# Altium schematic sheet mcu.SchDoc
size A
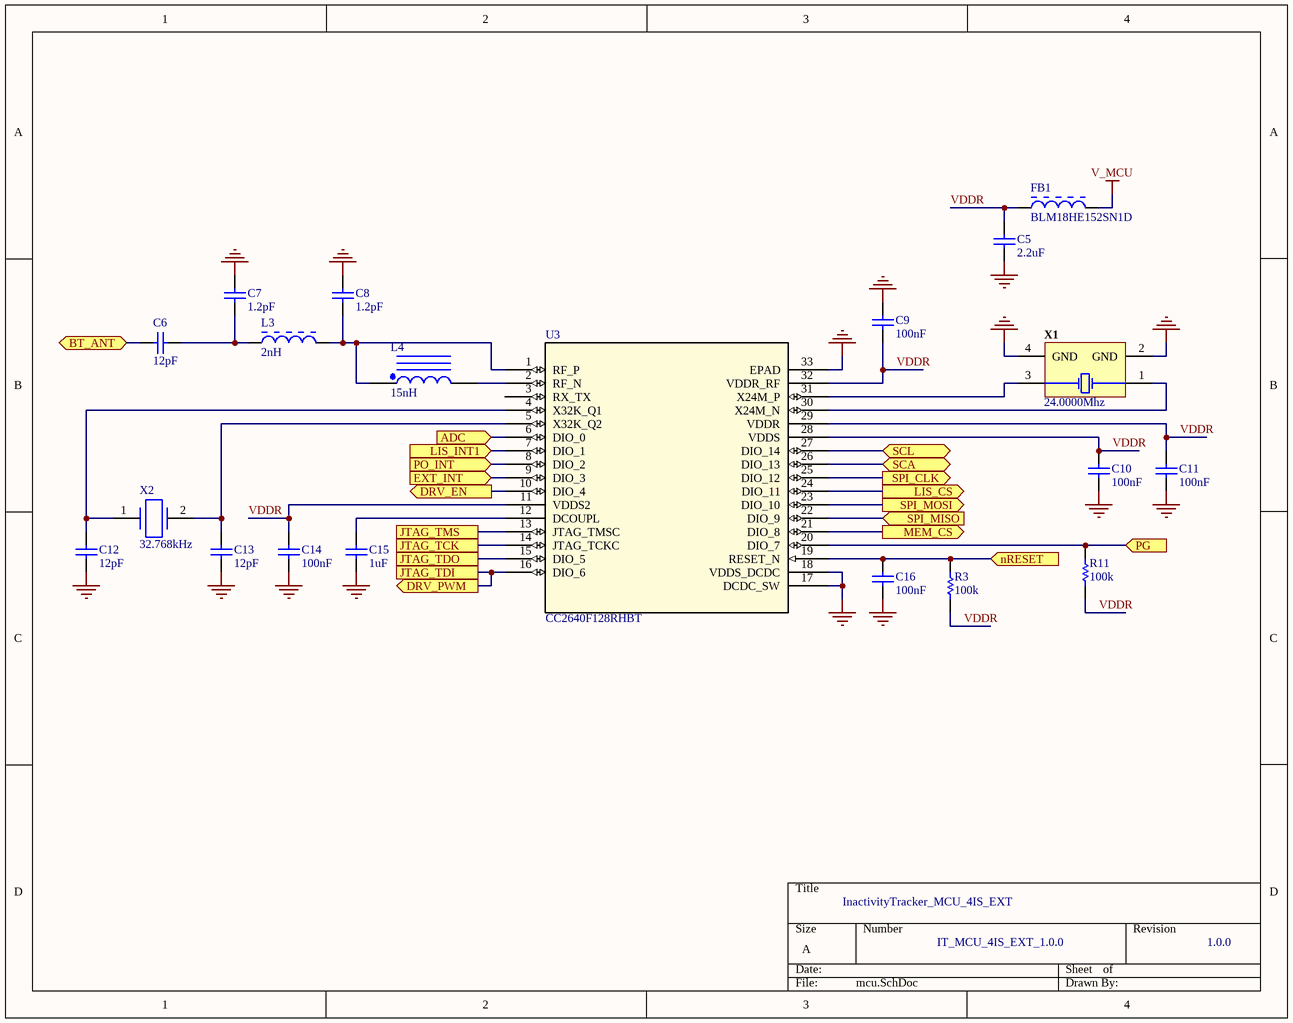
[diagram p0: mcu.SchDoc]

## Parts
C5  2.2uF  [CAPC1005X55X25ML05T10]
C6  12pF  [CAPC1005X55X25NL05T10]
C7  1.2pF  [CAPC1005X55X25ML05T10]
C8  1.2pF  [CAPC1005X55X25ML05T10]
C9  100nF  [CAPC1005X55X25NL05T10]
C10  100nF  [CAPC1005X55X25NL05T10]
C11  100nF  [CAPC1005X55X25NL05T10]
C12  12pF  [CAPC1005X55X25NL05T10]
C13  12pF  [CAPC1005X55X25NL05T10]
C14  100nF  [CAPC1005X55X25NL05T10]
C15  1uF  [CAPC1005X55X25NL5T10]
C16  100nF  [CAPC1005X55X25NL05T10]
FB1  BLM18HE152SN1D  [MURA-BLM18-RF-H4-CHIP-2_V]
L3  2nH  [MURA-IND0402_V]
L4  15nH  [INDC1005X55X25ML05T10_A]
R3  100k  [RESC1005X40X25ML05T05]
R11  100k  [RESC1005X40X25ML05T05]
U3  CC2640F128RHBT  [RHB32_3P45X3P45]
X1  24.0000Mhz  [EPSON-TSX-3225_V]
X2  32.768kHz  [XTAL320X150X75]

## Ports
ADC (in), BT_ANT (bidir), DRV_EN (out), DRV_PWM (out), EXT_INT (in), JTAG_TCK, JTAG_TDI, JTAG_TDO, JTAG_TMS, LIS_CS (out), LIS_INT1 (in), MEM_CS (out), nRESET (in), PG (in), PO_INT (in), SCA (bidir), SCL (bidir), SPI_CLK (out), SPI_MISO (in), SPI_MOSI (out)

## Nets
GND: C5.2 C7.1 C8.1 C9.2 C10.1 C11.1 C12.1 C13.1 C14.1 C15.2 C16.1 U3.17(DCDC_SW) U3.18(VDDS_DCDC) U3.33(EPAD) X1.2(GND) X1.4(GND)
V_MCU: FB1.2
ADC: U3.6(DIO_0) ; port ADC
BT_ANT: C6.1 ; port BT_ANT
DRV_EN: U3.10(DIO_4) ; port DRV_EN
DRV_PWM: U3.16(DIO_6) ; port JTAG_TDI, port DRV_PWM
EXT_INT: U3.9(DIO_3) ; port EXT_INT
JTAG_TCK: U3.14(JTAG_TCKC) ; port JTAG_TCK
JTAG_TDO: U3.15(DIO_5) ; port JTAG_TDO
JTAG_TMS: U3.13(JTAG_TMSC) ; port JTAG_TMS
LIS_CS: U3.24(DIO_11) ; port LIS_CS
LIS_INT1: U3.7(DIO_1) ; port LIS_INT1
MEM_CS: U3.21(DIO_8) ; port MEM_CS
nRESET: C16.2 R3.1 U3.19(RESET_N) ; port nRESET
PG: R11.1 U3.20(DIO_7) ; port PG
PO_INT: U3.8(DIO_2) ; port PO_INT
SCA: U3.26(DIO_13) ; port SCA
SCL: U3.27(DIO_14) ; port SCL
SPI_CLK: U3.25(DIO_12) ; port SPI_CLK
SPI_MISO: U3.22(DIO_9) ; port SPI_MISO
SPI_MOSI: U3.23(DIO_10) ; port SPI_MOSI
VDDR: C5.1 C9.1 C10.2 C11.2 C14.2 FB1.1 R3.2 R11.2 U3.11(VDDS2) U3.28(VDDS) U3.29(VDDR) U3.32(VDDR_RF)
NetC6_2: C6.2 C7.2 L3.1
NetC8_2: C8.2 L3.2 L4.1 U3.1(RF_P)
NetC12_2: C12.2 U3.4(X32K_Q1) X2.1
NetC13_2: C13.2 U3.5(X32K_Q2) X2.2
NetC15_1: C15.1 U3.12(DCOUPL)
NetL4_2: L4.2 U3.2(RF_N)
NetU3_30: U3.30(X24M_N) X1.1(X1)
NetU3_31: U3.31(X24M_P) X1.3(X2)

Not connected (* = marked no-connect by the designer): U3 3(RX_TX)

## Notes on the sheet
- InactivityTracker_MCU_4IS_EXT
- IT_MCU_4IS_EXT_1.0.0
- 1.0.0

## Library data of the parts
C5 = CMP-2008-04543-1: Part Number: GRM155R60J225ME15D; Manufacturer: Murata
C6 C12 C13 = CMP-2008-04258-1: Part Number: GRM1555C1H120JA01D; Manufacturer: Murata
C7 C8 = CMP-2008-04281-1: Manufacturer: Murata; Part Number: GRM1555C1H1R2CA01D
C9-C11 C14 C16 = CMP-2008-04639-1: Part Number: GRM155R71H104KE14D; Manufacturer: Murata
C15 = CMP-1662-00020-1: Chip Capacitor, 1 uF, +/- 10%, 6.3 V, -55 to 85 degC, 0402 (1005 Metric), RoHS, Tape and Reel; PartNumber: GRM155R60J105KE19D; Voltage Rating (DC): 3 V; Type (Capacitors): X5R; Voltage Rating: 6.3 V; ComponentLink2Description: Datasheet; ComponentLink2URL: http://psearch.en.murata.com/capacitor/product/GRM155R60J105KE19%23.pdf; Max Operating Temperature: 85 degC; Min Operating Temperature: -55 degC; Package Quantity: 10000; Mounting Technology: Surface Mount; ComponentLink1Description: Manufacturer URL; ComponentLink1URL: http://www.murata.com/; PackageDescription: 2-Pin Surface Mount Device, Body 1 x 0.5 mm; Tolerance: 10%; Case/Package: 0402; Mount: Surface Mount; Packaging: Tape and Reel; Case Code (Metric): 1005; Radiation Hardening: No; Width: 0.5 mm; Length: 1 mm; DatasheetVersion: 08/2016; Height: 0.5 mm; Capacitance: 1 uF; RoHSCompliant: true; Case Code (Imperial): 0402; REACH SVHC: No SVHC; Pins: 2
FB1 = CMP-0686-00368-2: Chip Ferrite Bead for GHz Band High-speed Signal Lines, 1500 Ohm, 500 mA, -55 to 125 degC, 1.6 x 0.8 x 0.95 mm SMD, Tape and Reel; Manufacturer: Murata; Rated Current: 500 mA; Impedance (at 100 MHz): 1500 Ohm +/- 25%; DC Resistance: 0.50 Ohm Max.; Packing: Tape and Reel; DatasheetVersion: 08/2013; ComponentLink1URL: http://www.murata.com/; Mounting Technology: Surface Mount; ComponentLink2URL: http://www.murata.com/products/catalog/pdf/c31e.pdf; ComponentLink3Description: Package Specification; ComponentLink2Description: Datasheet; PackageReference: BLM18_H950-2; ComponentLink1Description: Manufacturer URL; PackageDescription: 2-Pin Chip, Body 1.6 x 0.8 mm; ComponentLink3URL: http://www.murata.com/products/catalog/pdf/c31e.pdf; PartNumber: BLM18HE152SN1D; Operating Temperature Range: -55 to 125 degC
L3 = CMP-0499-00001-3: Chip Inductor (Chip Coil) for High Frequency Multilayer, 2 +/- 0.3 nH, 300 mA, 0402 (1005), 180mm Paper Tape; Manufacturer: Murata; PartNumber: LQG15HS2N0S02D; Self Resonance Frequency (min.): 6000 MHz; Inductance Test Frequency: 100 MHz; Inductance: 2.0 nH +/- 0.3 nH; Rated Current (Itemp) (Based on Temperature rise): 300 mA; Max. Of DC Resistance: 0.1 ohm; Q (min.): 8; Operating Temperature Range: -55 to 125 degC; Mounting Technology: Surface Mount; PackageDescription: 2-Pin SMT Inductor, 1 x 0.5 mm Body; ComponentLink2URL: http://search.murata.co.jp/Ceramy/image/img/PDF/ENG/L0075S0083LQG15HS.pdf; ComponentLink1Description: Manufacturer URL; ComponentLink3URL: http://search.murata.co.jp/Ceramy/image/img/PDF/ENG/L0075S0083LQG15HS.pdf; ComponentLink1URL: http://www.murata.com/; ComponentLink2Description: Datasheet; RoHS: Yes; ComponentLink3Description: Package Specification; Q Test Frequency: 100 MHz; PackageReference: IND0402
L4 = CMP-2100-03652-1: Chip Inductor, 15 nH, +/- 5%, 100 MHz, -55 to 125 degC, 0402 (1005 Metric), RoHS, Paper Tape; Manufacturer: Murata; DC Current: 300mA; Q Factor: 8; Self Resonant Frequency: 2.5GHz; DC Resistance (DCR): 320mOhm; Test Frequency: 100MHz; Shielding: Unshielded; Core Material: Air; Lead Free: LeadFree; Package Quantity: 10000; Package Description: 2-Pin Surface Mount Device, Body 1 x 0.5 mm; Case Code (Imperial): 0402; Termination: SMD/SMT; Datasheet URL: http://psearch.en.murata.com/inductor/product/LQG15HS15NJ02_.pdf; Case Code (Metric): 1005; Tolerance: 5%; Min Operating Temperature: -55degC; Radiation Hardening: No; Width: 0.02inch; Current Rating: 300mA; Packaging: TapeandReel; Height: 0.5mm; Manufacturer URL: http://www.murata.com/; Case/Package: 0402; Max DC Current: 300mA; Height - Seated (Max): 0.022inch; Package Reference: 0402; Length: 1mm; Max Operating Temperature: 125degC; Military Standard: Not; Datasheet Version: 42675.0; Depth: 0.55mm; Inductance: 15nh; RoHSCompliant: true
R3 R11 = CMP-2002-08123-2: Chip Resistor, 100 KOhm, +/- 1%, 0.63 W, -55 to 155 degC, 0402 (1005 Metric), RoHS, Tape and Reel; Voltage Rating: 50 V; Type (Resistor): Thick Film; Power Rating: 63 mW; Case\Package: 0402; Mount: Surface Mount; Packaging: Tape and Reel; Weight: 2.3E-05 oz; PackageDescription: 2-Pin Surface Mount Device, Body 1 x 0.5 mm; ComponentLink1Description: Manufacturer URL; ComponentLink2Description: Datasheet; Min Operating Temperature: -55 degC; Width: 0.5 mm; Resistance: 100 kohm; REACH SVHC: Unknown; ComponentLink2URL: http://www.vishay.com/docs/20035/dcrcwe3.pdf; Package Quantity: 10000; Mounting Technology: Surface Mount; PackageReference: 0402; ComponentLink1URL: http://www.vishay.com/; Max Operating Temperature: 155 degC; Length: 1 mm; DatasheetVersion: 06/2012; Height: 0.35 mm; Case Code (Imperial): 0402; Pins: 2; Tolerance: 1%; Case Code (Metric): 1005; Radiation Hardening: No; RoHSCompliant: true
U3 = CC2640F128RHBT: SimpleLink Wireless MCU; Vendor: Texas Instruments; Built_By: EMA_Jessica; Manufacturer_Part_Number: CC2640F128RHBT; Copyright: Copyright (C) 2018 Accelerated Designs. All rights reserved; RefDes: RefDes; Type: DEV; Value: Value
X1 = CMP-2000-07333-1: MHz Range Crystal, 24 MHz, -40 to 85 degC, 4-Pin SMD, RoHS, Tape and Reel; Manufacturer: Epson; Brand: EpsonTiming; Frequency Stability: 10PPM; Frequency: 24MHz; ESR: 40Ohms; Load Capacitance: 9pF; Unit Weight: 0.000564oz; Drive Level: 200uW; Datasheet Version: 12/2015; RoHS: True; Operating Temperature Range: -40Cto+85C; Length: 3.2mm; Tolerance: 10PPM; Width: 2.5mm; Mounting Technology: SurfaceMount; Package Description: 4-Pin Surface Mount Device, Body 3.2 x 2.5 mm; Manufacturer URL: https://www.eea.epson.com/; Factory Pack Quantity: 250; Package Reference: TSX-3225; Height: 0.6mm; Mounting Style: SMD/SMT; Termination Style: SMD/SMT; Datasheet URL: https://support.epson.biz/td/api/doc_check.php?dl=brief_FA-238V_en.pdf; Type: Crystal; Series: TSX-3225; Package / Case: 3.2mmx2.5mm; Product Category: Crystals; Packaging: Reel
X2 = 9HT10-32.768KDZY-T: TXC - 9HT10-32.768KDZY-T - CRYSTAL, 32.768KHZ, 7PF, 3.2 X 1.5MM; Tolerance: 20ppm; ESR (Equivalent Series Resistance): 70kR; Supplier 1: Digi-Key; Manufacturer: TXC; Manufacturer Part Number: 9HT10-32.768KDZY-T; RoHS: Yes; Category: Crystals; Stock 1: 3909; Pricing 1: 1=0.66000, 10=0.55000, 50=0.49500, 100=0.44000, 500=0.41800, 1000=0.35200 (USD); Mount: Surface Mount; Case/Package: SMD/SMT; Number of Pins: 2; Min Operating Temperature: -40°C; Max Operating Temperature: 85°C; Termination: SMD/SMT; Package Quantity: 1; Frequency: 32.768kHz; Load Capacitance: 7pF; Packaging: Tape and Reel; Frequency Tolerance: 20ppm; Length: 0.126inch; Height: 0.033inch; Width: 1.5mm; Lead Free: Lead Free; REACH SVHC: No SVHC; ComponentLink1URL: https://datasheet.ciiva.com/856/9ht10-856052.pdf?src-supplier=Digi-Key; ComponentLink1Description: https://datasheet.ciiva.com/856/9ht10-856052.pdf?src-supplier=Digi-Key; ComponentLink2URL: https://datasheet.ciiva.com/856/9ht10-856053.pdf?src-supplier=Digi-Key; ComponentLink2Description: https://datasheet.ciiva.com/856/9ht10-856053.pdf?src-supplier=Digi-Key; ComponentLink3URL: https://datasheet.ciiva.com/8047/9ht10-8047909.pdf?src-supplier=Element14; ComponentLink3Description: https://datasheet.ciiva.com/8047/9ht10-8047909.pdf?src-supplier=Element14; ComponentLink4URL: https://datasheet.ciiva.com/856/9ht10-856054.pdf?src-supplier=Digi-Key; ComponentLink4Description: https://datasheet.ciiva.com/856/9ht10-856054.pdf?src-supplier=Digi-Key; Supplier Part Number 1: 887-1506-1-ND